# Altium project Brake Light Flasher.PrjPcb
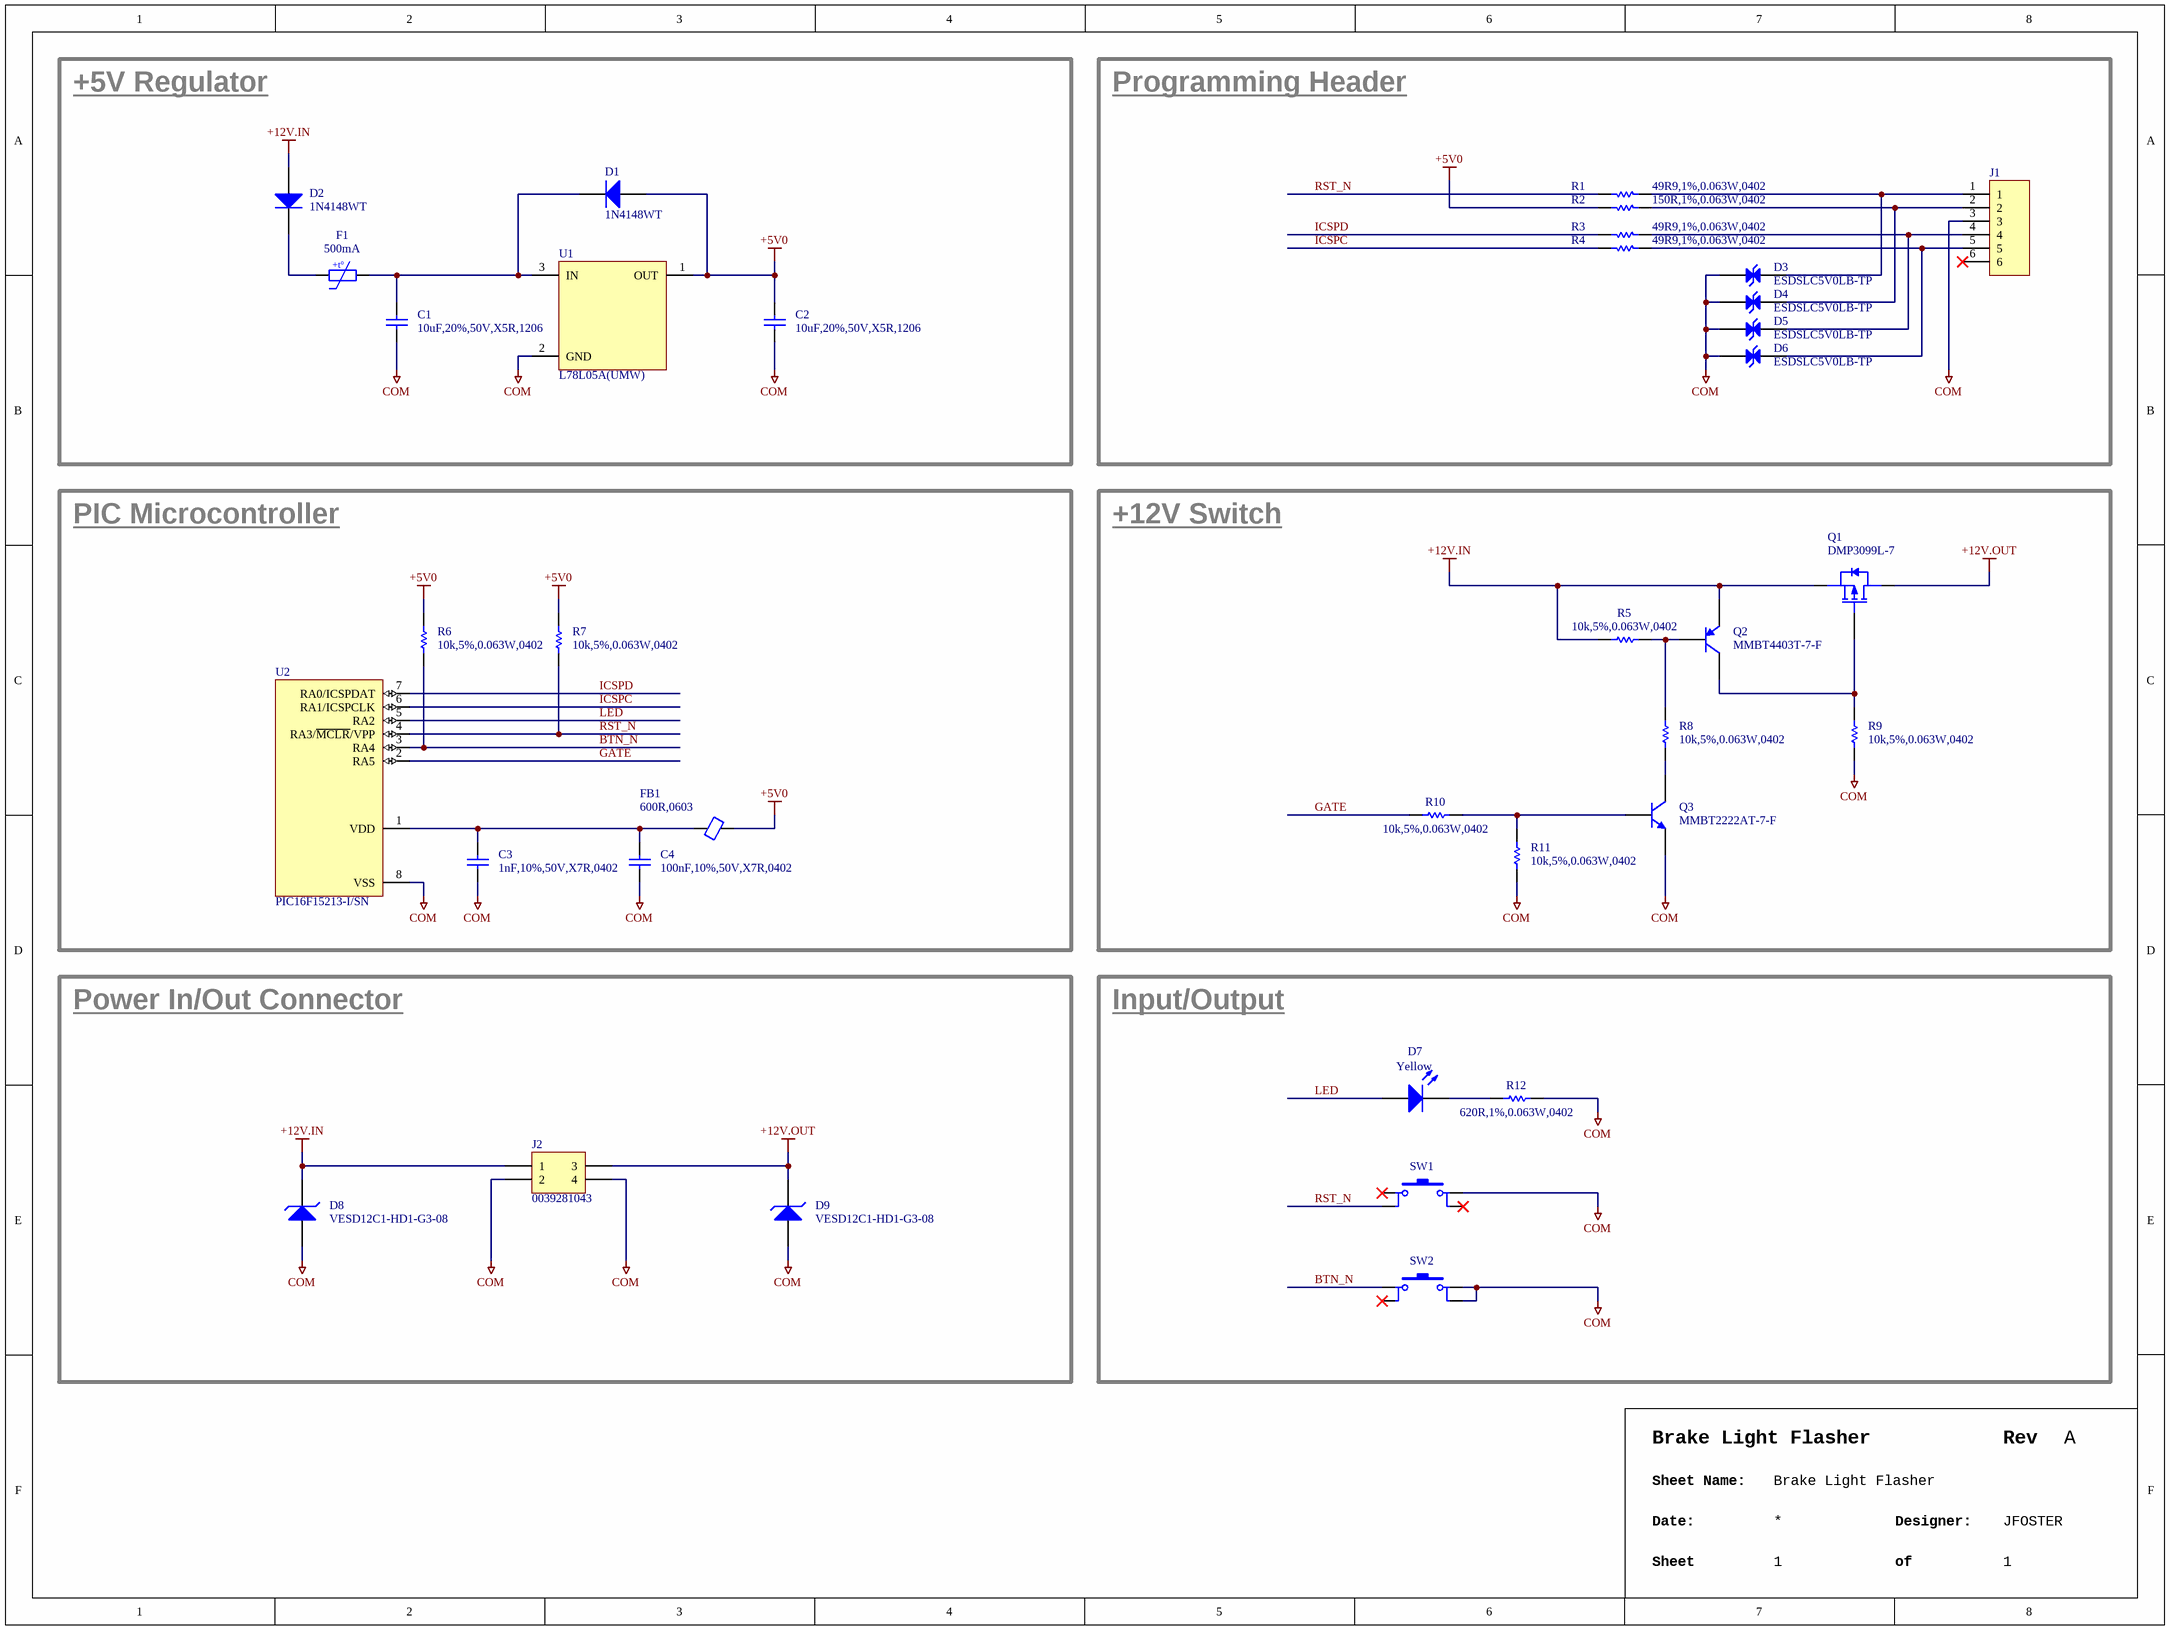
[diagram p0: Brake Light Flasher.SchDoc]
Designer: JFOSTER; ProjectNameNoExt: Brake Light Flasher; Revision: A
1 sheet, 36 parts. Net scope: global (net labels, ports and power ports of the same name join across sheets).
Board file: Brake Light Flasher.PcbDoc

## Sheet Brake Light Flasher.SchDoc: Brake Light Flasher
size 406 x 304 mm; SheetNumber: 1; SheetTotal: 1

### Parts
C1  10uF,20%,50V,X5R,1206  [CAPC3216X16N]
C2  10uF,20%,50V,X5R,1206  [CAPC3216X16N]
C3  1nF,10%,50V,X7R,0402  [CAPC1005X06N]
C4  100nF,10%,50V,X7R,0402  [CAPC1005X06N]
D1  1N4148WT  [ONSEMI_PKG_SOD-523F]
D2  1N4148WT  [ONSEMI_PKG_SOD-523F]
D3  ESDSLC5V0LB-TP  [MICROCOMMERCIAL_DFN1006-2_NPOL]
D4  ESDSLC5V0LB-TP  [MICROCOMMERCIAL_DFN1006-2_NPOL]
D5  ESDSLC5V0LB-TP  [MICROCOMMERCIAL_DFN1006-2_NPOL]
D6  ESDSLC5V0LB-TP  [MICROCOMMERCIAL_DFN1006-2_NPOL]
D7  Yellow  [LITE-ON_LTST-C190KSKT]
D8  VESD12C1-HD1-G3-08  [VISHAY_PKG_DFN1006-2A]
D9  VESD12C1-HD1-G3-08  [VISHAY_PKG_DFN1006-2A]
F1  500mA  [BELFUSE_CHIP1812]
FB1  600R,0603  [INDC_0603]
J1  Term,Header,6 Pin,Top,2.54mm  [WURTH_61300611121]  (value not drawn)
J2  0039281043  [MOLEX_0039281043]
Q1  DMP3099L-7  [DIODES_SOT23]
Q2  MMBT4403T-7-F  [DIODES_SOT523]
Q3  MMBT2222AT-7-F  [SOTFL50P160X90-3N]
R1  49R9,1%,0.063W,0402  [RESC1005X04N]
R2  150R,1%,0.063W,0402  [RESC1005X04N]
R3  49R9,1%,0.063W,0402  [RESC1005X04N]
R4  49R9,1%,0.063W,0402  [RESC1005X04N]
R5  10k,5%,0.063W,0402  [RESC1005X04N]
R6  10k,5%,0.063W,0402  [RESC1005X04N]
R7  10k,5%,0.063W,0402  [RESC1005X04N]
R8  10k,5%,0.063W,0402  [RESC1005X04N]
R9  10k,5%,0.063W,0402  [RESC1005X04N]
R10  10k,5%,0.063W,0402  [RESC1005X04N]
R11  10k,5%,0.063W,0402  [RESC1005X04N]
R12  620R,1%,0.063W,0402  [RESC1005X04N]
SW1  PTS525SM15SMTR2 LFS  [C&K_PTS525SM15SMTR2 LFS]  (value not drawn)
SW2  PTS525SM15SMTR2 LFS  [C&K_PTS525SM15SMTR2 LFS]  (value not drawn)
U1  L78L05A(UMW)  [UMW_PKG_SOT-89-3]
U2  PIC16F15213-I/SN  [MICROCHIP_PKG_SOIC-8(C04-2057-SN)]

### Blocks framed on the sheet
+5V Regulator: C1 C2 D1 D2 F1 U1
Programming Header: D3-D6 J1 R1-R4
PIC Microcontroller: C3 C4 FB1 R6 R7 U2
+12V Switch: Q1-Q3 R5 R8-R11
Power In/Out Connector: D8 D9 J2
Input/Output: D7 R12 SW1 SW2

### Nets
+5V0: C2.2 D1.2(A) FB1.2 R2.1 R6.2 R7.2 U1.1(OUT)
+12V.IN: D2.2(A) D8.2(K) J2.1 Q1.2(S) Q2.2(E) R5.2
+12V.OUT: D9.2(K) J2.3 Q1.3(D)
COM: C1.1 C2.1 C3.1 C4.1 D3.1(K) D4.1(K) D5.1(K) D6.1(K) D8.1(A) D9.1(A) J1.3 J2.2 J2.4 Q3.2(E) R9.1 R11.1 R12.2 SW1.3 SW2.3 SW2.4 U1.2(GND) U2.8(VSS)
BTN_N: R6.1 SW2.1 U2.3(RA4)
GATE: R10.2 U2.2(RA5)
ICSPC: R4.2 U2.6(RA1/ICSPCLK)
ICSPD: R3.2 U2.7(RA0/ICSPDAT)
LED: D7.A U2.5(RA2)
RST_N: R1.2 R7.1 SW1.2 U2.4(RA3/~{MCLR}/VPP)
NetC1_2: C1.2 D1.1(K) F1.2 U1.3(IN)
NetC3_2: C3.2 C4.2 FB1.1 U2.1(VDD)
NetD2_1: D2.1(K) F1.1
NetD3_2: D3.2(A) J1.1 R1.1
NetD4_2: D4.2(A) J1.2 R2.2
NetD5_2: D5.2(A) J1.4 R3.1
NetD6_2: D6.2(A) J1.5 R4.1
NetD7_C: D7.C R12.1
NetQ1_1: Q1.1(G) Q2.3(C) R9.2
NetQ2_1: Q2.1(B) R5.1 R8.2
NetQ3_1: Q3.1(B) R10.1 R11.2
NetQ3_3: Q3.3(C) R8.1

Not connected (* = marked no-connect by the designer): J1 6*; SW1 1* 4*; SW2 2*

### Notes on the sheet
- Rev
- Sheet Name:
- Date:
- Sheet
- Designer:
- of
- (in symbol PTC,30V,500mA,1812) +t°

### Library data of the parts
C1 C2 = CAP,Cer,10uF,50VDC,X5R,1206: 10ï¿½F ï¿½20% 50V Ceramic Capacitor X5R 1206 (3216 Metric); Manufacturer 1: Samsung Electro-Mechanics; Manufacturer 1 Part Number: CL31A106MBHNNNE; Vendor 1 Part Number: 1276-6736-1-ND; Vendor 1: Digikey; Value: 10u; Part Name: CAP,Cer,10uF,50VDC,X5R,1206; CreatedBy: Judd Foster; HelpURL: https://www.samsungsem.com/resources/file/global/support/product_catalog/MLCC.pdf
C3 = CAP,Cer,1nF,10%,50V,X7R,0402: 1000pF ï¿½10% 50V Ceramic Capacitor X7R 0402 (1005 Metric); Manufacturer 1: Murata Electronics; Manufacturer 1 Part Number: GCM155R71H102KA37D; Vendor 1 Part Number: 490-4761-1-ND; Vendor 1: Digikey; Value: 1n; Part Name: CAP,Cer,1nF,10%,50V,X7R,0402; CreatedBy: Judd Foster; HelpURL: https://www.murata.com/~/media/webrenewal/support/library/catalog/products/capacitor/mlcc/c03e.ashx?la=en-us
C4 = CAP,Cer,100nF,10%,50V,X7R,0402: 50V 100nF X7R Â±10% 0402 Ceramic Capacitors ROHS; Manufacturer 1: Murata; Manufacturer 1 Part Number: GRM155R71H104KE14D; Vendor 1 Part Number: C77020; Vendor 1: LCSC; Value: 100n; Part Name: CAP,Cer,100nF,10%,50V,X7R,0402; CreatedBy: Judd Foster; HelpURL: https://www.lcsc.com/datasheet/C77020.pdf
D1 D2 = DIODE,Gen,75V,150mA,SOD523F: Diode 75 V 200mA Surface Mount SOD-523F; Manufacturer 1: onsemi; Vendor 1 Part Number: 1N4148WTCT-ND; Vendor 1: DigiKey; Part Name: DIODE,Gen,75V,150mA,SOD523F; CreatedBy: Judd Foster; HelpURL: https://mm.digikey.com/Volume0/opasdata/d220001/medias/docus/6621/1N914BWTCND.pdf; Manufacturer 1 Part Number: 1N4148WT
D3-D6 = DIODE,TVS,5.0V,SOD882: 20V Clamp 4A (8/20ï¿½s) Ipp Tvs Diode Surface Mount 2-DFN1006; Manufacturer 1: Micro Commercial Co; Vendor 1 Part Number: ESDSLC5V0LB-TPMSCT-ND; Vendor 1: Digikey; Part Name: DIODE,TVS,5.0V,SOD882; CreatedBy: Judd Foster; HelpURL: https://www.mccsemi.com/pdf/Products/ESDSLC5V0LB(DFN1006-2).pdf; Manufacturer 1 Part Number: ESDSLC5V0LB-TP
D7 = LED,Yellow,SMD,0603: Yellow 591nm LED Indication - Discrete 2.1V 0603 (1608 Metric); Manufacturer 1: Lite-On Inc.; Manufacturer 1 Part Number: LTST-C190KSKT; Vendor 1 Part Number: 160-1437-1-ND; Vendor 1: Digikey; Part Name: LED,Yellow,SMD,0603; CreatedBy: Judd Foster; HelpURL: https://optoelectronics.liteon.com/upload/download/DS-22-99-0189/LTST-C190KSKT.pdf; Value: Yellow
D8 D9 = DIODE,ESD,12V,DFN1006-2A: Transient Voltage Suppression Diodes - TVS ESD 12V UNI; Manufacturer 1: Vishay; Vendor 1 Part Number: 78-VESD12C1-HD1-G308; Vendor 1: Mouser; Part Name: DIODE,ESD,12V,DFN1006-2A; CreatedBy: Judd Foster; HelpURL: https://www.vishay.com/docs/86185/vesd01c1-hd1tovesd33c1-hd1.pdf; Manufacturer 1 Part Number: VESD12C1-HD1-G3-08
F1 = PTC,30V,500mA,1812: Polymeric PTC Resettable Fuse 30V 500 mA Ih Surface Mount 1812 (4532 Metric), Concave; Manufacturer 1: Bel Fuse Inc.; Manufacturer 1 Part Number: 0ZCG0050AF2C; Vendor 1 Part Number: 507-1762-1-ND; Vendor 1: Digikey; Part Name: PTC,30V,500mA,1812; CreatedBy: Judd Foster; HelpURL: https://www.belfuse.com/resources/datasheets/circuitprotection/ds-cp-0zcg-series.pdf; Value: 500mA
FB1 = FERRITE,600R@100MHz,350mA,0603: 500mÎ© Â±25% 600Î©@100MHz 0603 Ferrite Beads and Chips ROHS; Manufacturer 1: TAI-TECH; Manufacturer 1 Part Number: FCM1608KF-601T03; Vendor 1 Part Number: C141723; Vendor 1: LCSC; Part Name: FERRITE,600R@100MHz,350mA,0603; CreatedBy: Judd Foster; HelpURL: https://www.lcsc.com/datasheet/C141723.pdf
J1 = Term,Header,6 Pin,Top,2.54mm: Connector Header Through Hole 6 position 0.100" (2.54mm); Manufacturer 1: WÃ¼rth Elektronik; Manufacturer 1 Part Number: 61300611121; Vendor 1 Part Number: 732-5319-ND; Vendor 1: DigiKey; Part Name: Term,Header,6 Pin,Top,2.54mm; CreatedBy: Judd Foster; HelpURL: https://www.we-online.com/components/products/datasheet/61300611121.pdf
J2 = CONN,Mini-Fit-Jr,Hdr,2x2,Pos,Vert,Thru: Connector Header Through Hole 4 position 0.165" (4.20mm); Manufacturer 1: Molex; Vendor 1 Part Number: WM3801-ND; Vendor 1: DigiKey; Part Name: CONN,Mini-Fit-Jr,Hdr,2x2,Pos,Vert,Thru; CreatedBy: Judd Foster; HelpURL: https://www.molex.com/en-us/products/part-detail/39281043?display=pdf; Manufacturer 1 Part Number: 0039281043
Q1 = MOSFET,P Ch,30V,3.8A: P-Channel 30 V 3.8A (Ta) 1.08W (Ta) Surface Mount SOT-23-3; Manufacturer 1: Diodes Incorporated; Vendor 1 Part Number: DMP3099L-7DICT-ND; Vendor 1: Digikey; Part Name: MOSFET,P Ch,30V,3.8A; CreatedBy: Judd Foster; HelpURL: https://www.diodes.com/assets/Datasheets/DMP3099L.pdf; Manufacturer 1 Part Number: DMP3099L-7
Q2 = Trans,PNP,40V,600mA,SOT523: Bipolar (BJT) Transistor PNP 40 V 600 mA 200MHz 150 mW Surface Mount SOT-523; Manufacturer 1: Diodes Incorporated; Vendor 1 Part Number: MMBT4403T-FDICT-ND; Vendor 1: Digikey; Part Name: Trans,PNP,40V,600mA,SOT523; CreatedBy: Judd Foster; HelpURL: https://www.diodes.com/assets/Datasheets/ds30273.pdf; Manufacturer 1 Part Number: MMBT4403T-7-F
Q3 = Trans,NPN,40V,600mA,SOT523: Bipolar (BJT) Transistor NPN 40 V 600 mA 300MHz 150 mW Surface Mount SOT-523; Manufacturer 1: Diodes Incorporated; Vendor 1 Part Number: MMBT2222AT-FDICT-ND; Vendor 1: Digikey; Part Name: Trans,NPN,40V,600mA,SOT523; CreatedBy: Judd Foster; HelpURL: https://media.digikey.com/pdf/Data%20Sheets/Diodes%20PDFs/MMBT2222AT_Rev2016.pdf; Manufacturer 1 Part Number: MMBT2222AT-7-F
R1 R3 R4 = RES,49R9,1%,0.063W,0402: 49.9 Ohms Â±1% 0.063W, 1/16W Chip Resistor 0402 (1005 Metric) Moisture Resistant Thick Film; Manufacturer 1: YAGEO; Manufacturer 1 Part Number: RC0402FR-0749R9L; Vendor 1 Part Number: 311-49.9LRCT-ND; Vendor 1: DigiKey; Value: 49.9; Part Name: RES,49R9,1%,0.063W,0402; CreatedBy: Judd Foster; HelpURL: https://www.yageo.com/upload/media/product/products/datasheet/rchip/PYu-RC_Group_51_RoHS_L_12.pdf
R2 = RES,150R,1%,0.1W,0402: 150 Ohms ï¿½1% 0.063W, 1/16W Chip Resistor 0402 (1005 Metric) Automotive AEC-Q200, Moisture Resistant Thick Film; Manufacturer 1: TE Connectivity Passive Product; Manufacturer 1 Part Number: CRGCQ0402F150R; Vendor 1 Part Number: A129617CT-ND; Vendor 1: Digikey; Value: 150; Part Name: RES,150R,1%,0.1W,0402; CreatedBy: Judd Foster; HelpURL: https://www.te.com/commerce/DocumentDelivery/DDEController?Action=srchrtrv&DocNm=1773204-3&DocType=DS&DocLang=English
R5-R11 = RES,10k,5%,0.063W,0402: 10 kOhms ï¿½5% 0.063W, 1/16W Chip Resistor 0402 (1005 Metric) Automotive AEC-Q200 Thick Film; Manufacturer 1: Stackpole Electronics Inc; Manufacturer 1 Part Number: RMCF0402JT10K0; Vendor 1 Part Number: RMCF0402JT10K0CT-ND; Vendor 1: DIgikey; Part Name: RES,10k,5%,0.063W,0402; CreatedBy: Judd Foster; HelpURL: https://www.seielect.com/catalog/sei-rmcf_rmcp.pdf; Value: 10k
R12 = RES,620R,1%,0.063W,0402: 620 Ohms Â±1% 0.063W, 1/16W Chip Resistor 0402 (1005 Metric) Thin Film; Manufacturer 1: YAGEO; Manufacturer 1 Part Number: RT0402FRE07620RL; Vendor 1 Part Number: 13-RT0402FRE07620RLCT-ND; Vendor 1: DigiKey; Value: 620; Part Name: RES,620R,1%,0.063W,0402; CreatedBy: Judd Foster; HelpURL: https://www.yageo.com/upload/media/product/app/datasheet/rchip/pyu-rt_1-to-0.01_rohs_l.pdf
SW1 SW2 = Switch,Tactile,SPST-NO,SMD,H1.5: Tactile Switch SPST-NO Top Actuated Surface Mount; Manufacturer 1: C&K; Vendor 1 Part Number: CKN9104CT-ND; Vendor 1: Digikey; Part Name: Switch,Tactile,SPST-NO,SMD,H1.5; CreatedBy: Judd Foster; HelpURL: https://www.ckswitches.com/media/1467/pts525.pdf; Manufacturer 1 Part Number: PTS525SM15SMTR2 LFS
U1 = L78L05A(UMW): Linear Voltage Regulator IC Positive Fixed 1 Output 100mA SO-8; Vendor 1 Part Number: C2681223; Vendor 1: LCSC; Part Name: L78L05A(UMW); CreatedBy: Judd Foster; HelpURL: https://www.lcsc.com/datasheet/C2681223.pdf?spm=wm.sxq.inf.ggs___wm.ssy.bg.7.xh&lcsc_vid=TgUPBFBSFFFWXgUFE1cMXgdVTgVYX1NfTlZZX1NSQlYxVlNRQFBbVVFWQFdYVTsOAxUeFF5JWBYZEEoKFBINSQcJGk4%3D; Manufacturer 1: UMW; Manufacturer 1 Part Number: L78L05A(UMW)
U2 = PIC16F15213-I_SN: PIC PICÂ® 16F, Functional Safety (FuSa) Microcontroller IC 8-Bit 32MHz 3.5KB (2K x 14) FLASH 8-SOIC; Manufacturer 1: Microchip; Vendor 1 Part Number: 150-PIC16F15213-I/SN-ND; Vendor 1: DigiKey; Part Name: PIC16F15213-I_SN; CreatedBy: Judd Foster; HelpURL: https://ww1.microchip.com/downloads/en/DeviceDoc/PIC16F15213-14-23-24-43-44-Data-Sheet-40002195D.pdf; Manufacturer 1 Part Number: PIC16F15213-I/SN

## Assembly variants
Production: not fitted J1